# EAGLE design coilcube (EAGLE 6.5.0)
REV: C; TITLE: Coilcube

## Sheet 1 of 2: EPIC & Programmer
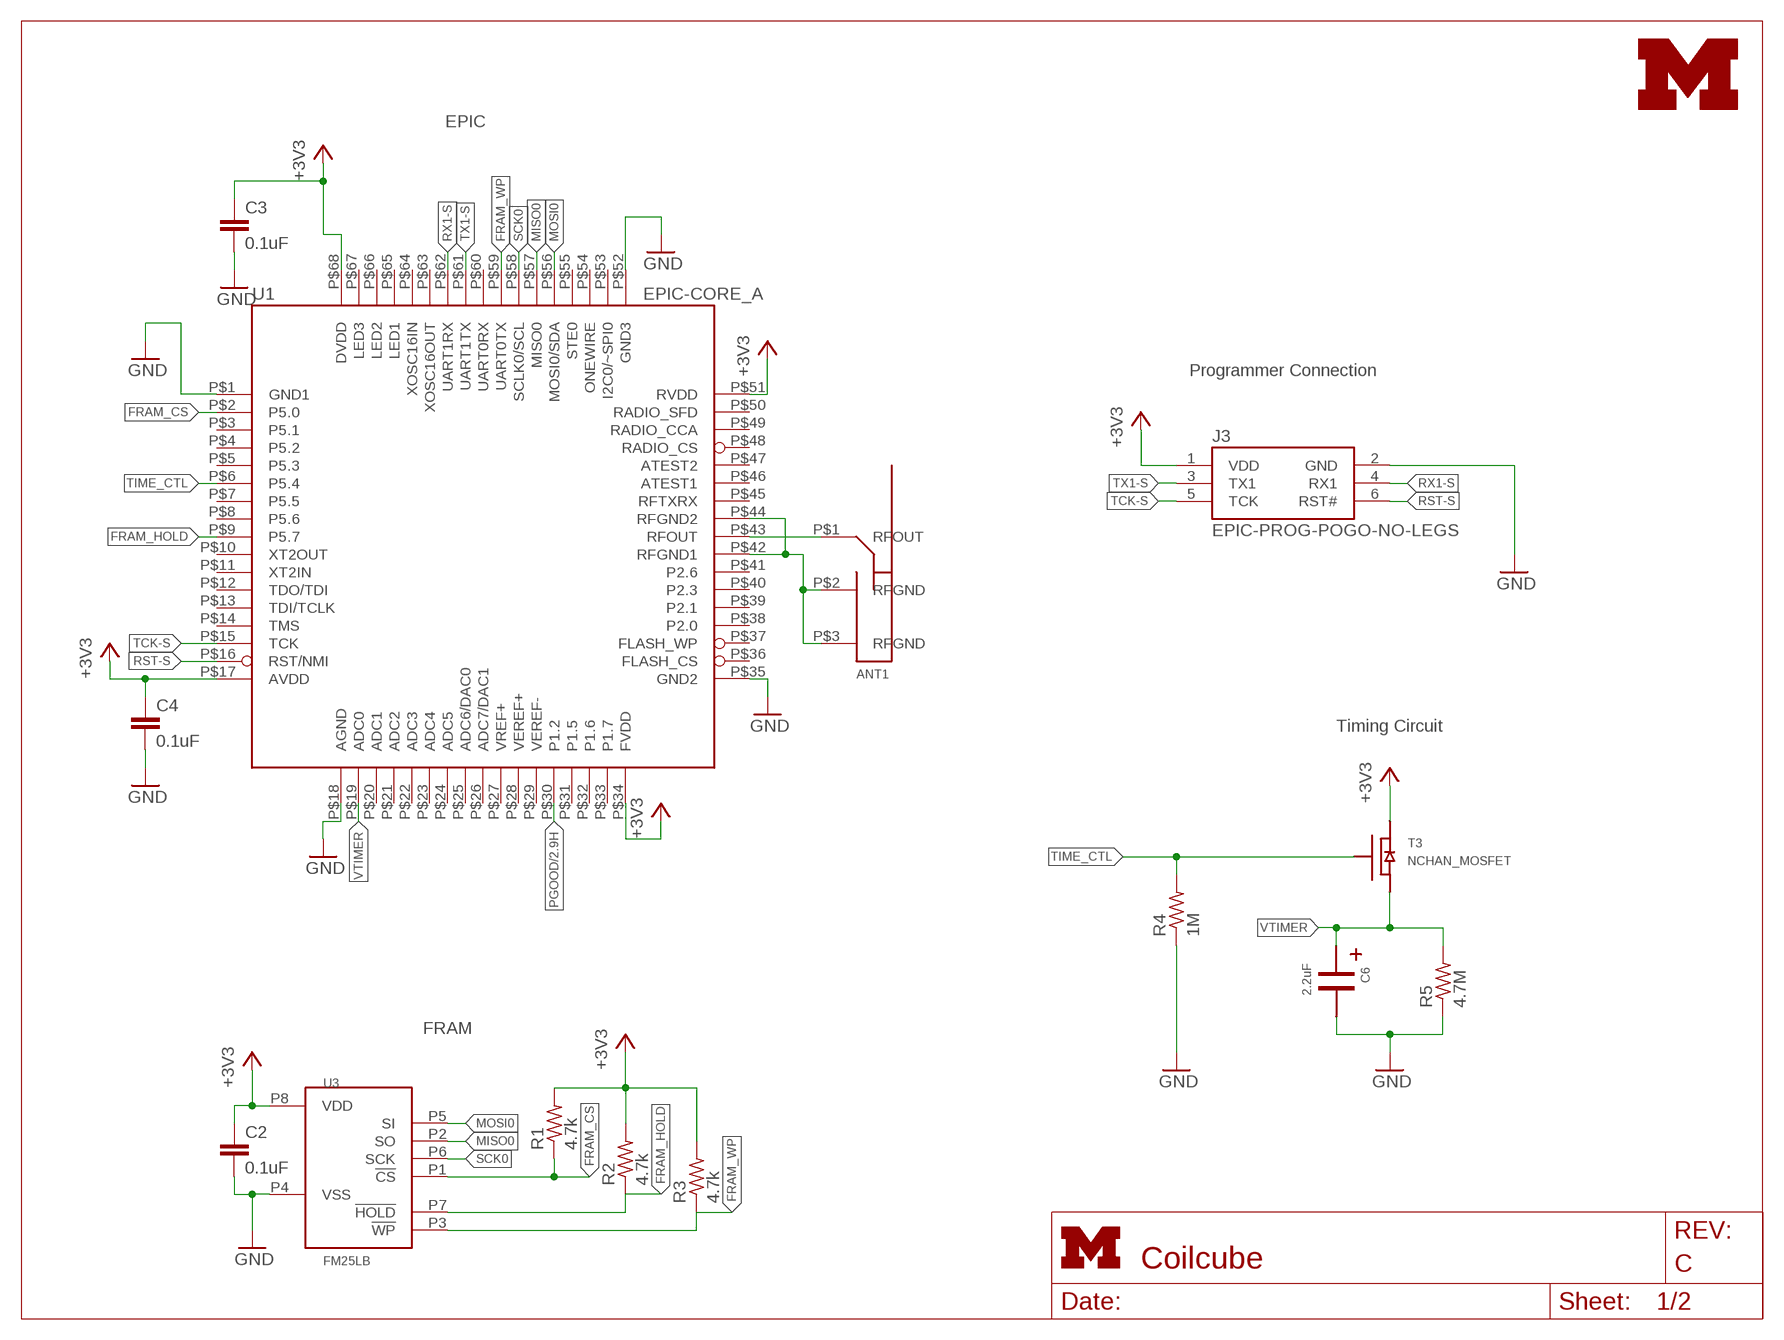
[diagram p0: schematic, sheet 1]
FRAME1 (LETTER_L): HEIGHT: 8.5in; WIDTH: 11in

### Parts
ANT1  PIFA-2.4GHZ  [PIFA-2.4GHZ]
C2  0.1uF  C-EUC0603  [C0603]
C3  0.1uF  C-EUC0603  [C0603]
C4  0.1uF  C-EUC0603  [C0603]
C6  2.2uF  CAP_POLEA1MM5  [CPOL_EEA_1MM5]
J3  EPIC-PROG-POGO-NO-LEGS  [TC2030-IDC-NL]
R1  4.7k  R-US_R0603  [R0603]
R2  4.7k  R-US_R0603  [R0603]
R3  4.7k  R-US_R0603  [R0603]
R4  1M  R-US_R0603  [R0603]
R5  4.7M  R-US_R0603  [R0603]
T3  NCHAN_MOSFET  [NCHAN_MOSFET]
U1  EPIC-CORE_A  [EPIC-LCC68]
U3  FM25LB  [SOIC_8]
U$1  UMICH_SOLID_MEDIUM  [UMICH_SOLID_200MIL]

### Nets
+3V3: C2.1 C3.1 C4.1 J3.1(VDD) R1.2 R2.2 R3.2 T3.D U1.P$17(AVDD) U1.P$34(FVDD) U1.P$51(RVDD) U1.P$68(DVDD) U3.P8(VDD) ; also sheet 2
FRAM_CS: R1.1 U1.P$2(P5.0) U3.P1(!CS)
FRAM_HOLD: R2.1 U1.P$9(P5.7) U3.P7(!HOLD)
FRAM_WP: R3.1 U1.P$59(UART0TX) U3.P3(!WP)
GND: C2.2 C3.2 C4.2 C6.- J3.2(GND) R4.1 R5.1 U1.P$1(GND1) U1.P$18(AGND) U1.P$35(GND2) U1.P$52(GND3) U3.P4(VSS) ; also sheet 2
MISO0: U1.P$57(MISO0) U3.P2(SO)
MOSI0: U1.P$56(MOSI0/SDA) U3.P5(SI)
N$1: ANT1.P$1(RFOUT) U1.P$43(RFOUT)
PGOOD: U1.P$30(P1.2) ; also sheet 2
RFGND: ANT1.P$2(RFGND) ANT1.P$3(RFGND) U1.P$42(RFGND1) U1.P$44(RFGND2)
RST-S: J3.6(RST#) U1.P$16(RST/NMI)
RX1-S: J3.4(RX1) U1.P$62(UART1RX)
SCK0: U1.P$58(SCLK0/SCL) U3.P6(SCK)
TCK-S: J3.5(TCK) U1.P$15(TCK)
TIME_CTL: R4.2 T3.G U1.P$6(P5.4)
TX1-S: J3.3(TX1) U1.P$61(UART1TX)
VTIMER: C6.+ R5.2 T3.S U1.P$19(ADC0)
Unconnected: U1.P$3(P5.1) U1.P$4(P5.2) U1.P$5(P5.3) U1.P$7(P5.5) U1.P$8(P5.6) U1.P$10(XT2OUT) U1.P$11(XT2IN) U1.P$12(TDO/TDI) U1.P$13(TDI/TCLK) U1.P$14(TMS) U1.P$20(ADC1) U1.P$21(ADC2) U1.P$22(ADC3) U1.P$23(ADC4) U1.P$24(ADC5) U1.P$25(ADC6/DAC0) U1.P$26(ADC7/DAC1) U1.P$27(VREF+) U1.P$28(VEREF+) U1.P$29(VEREF-) U1.P$31(P1.5) U1.P$32(P1.6) U1.P$33(P1.7) U1.P$36(FLASH_CS) U1.P$37(FLASH_WP) U1.P$38(P2.0) U1.P$39(P2.1) U1.P$40(P2.3) U1.P$41(P2.6) U1.P$45(RFTXRX) U1.P$46(ATEST1) U1.P$47(ATEST2) U1.P$48(RADIO_CS) U1.P$49(RADIO_CCA) U1.P$50(RADIO_SFD) U1.P$53(I2C0/~SPI0) U1.P$54(ONEWIRE) U1.P$55(STE0) U1.P$60(UART0RX) U1.P$63(XOSC16OUT) U1.P$64(XOSC16IN) U1.P$65(LED1) U1.P$66(LED2) U1.P$67(LED3)

### Notes on the sheet
- EPIC
- Programmer Connection
- Timing Circuit
- FRAM

## Sheet 2 of 2: Power Supply
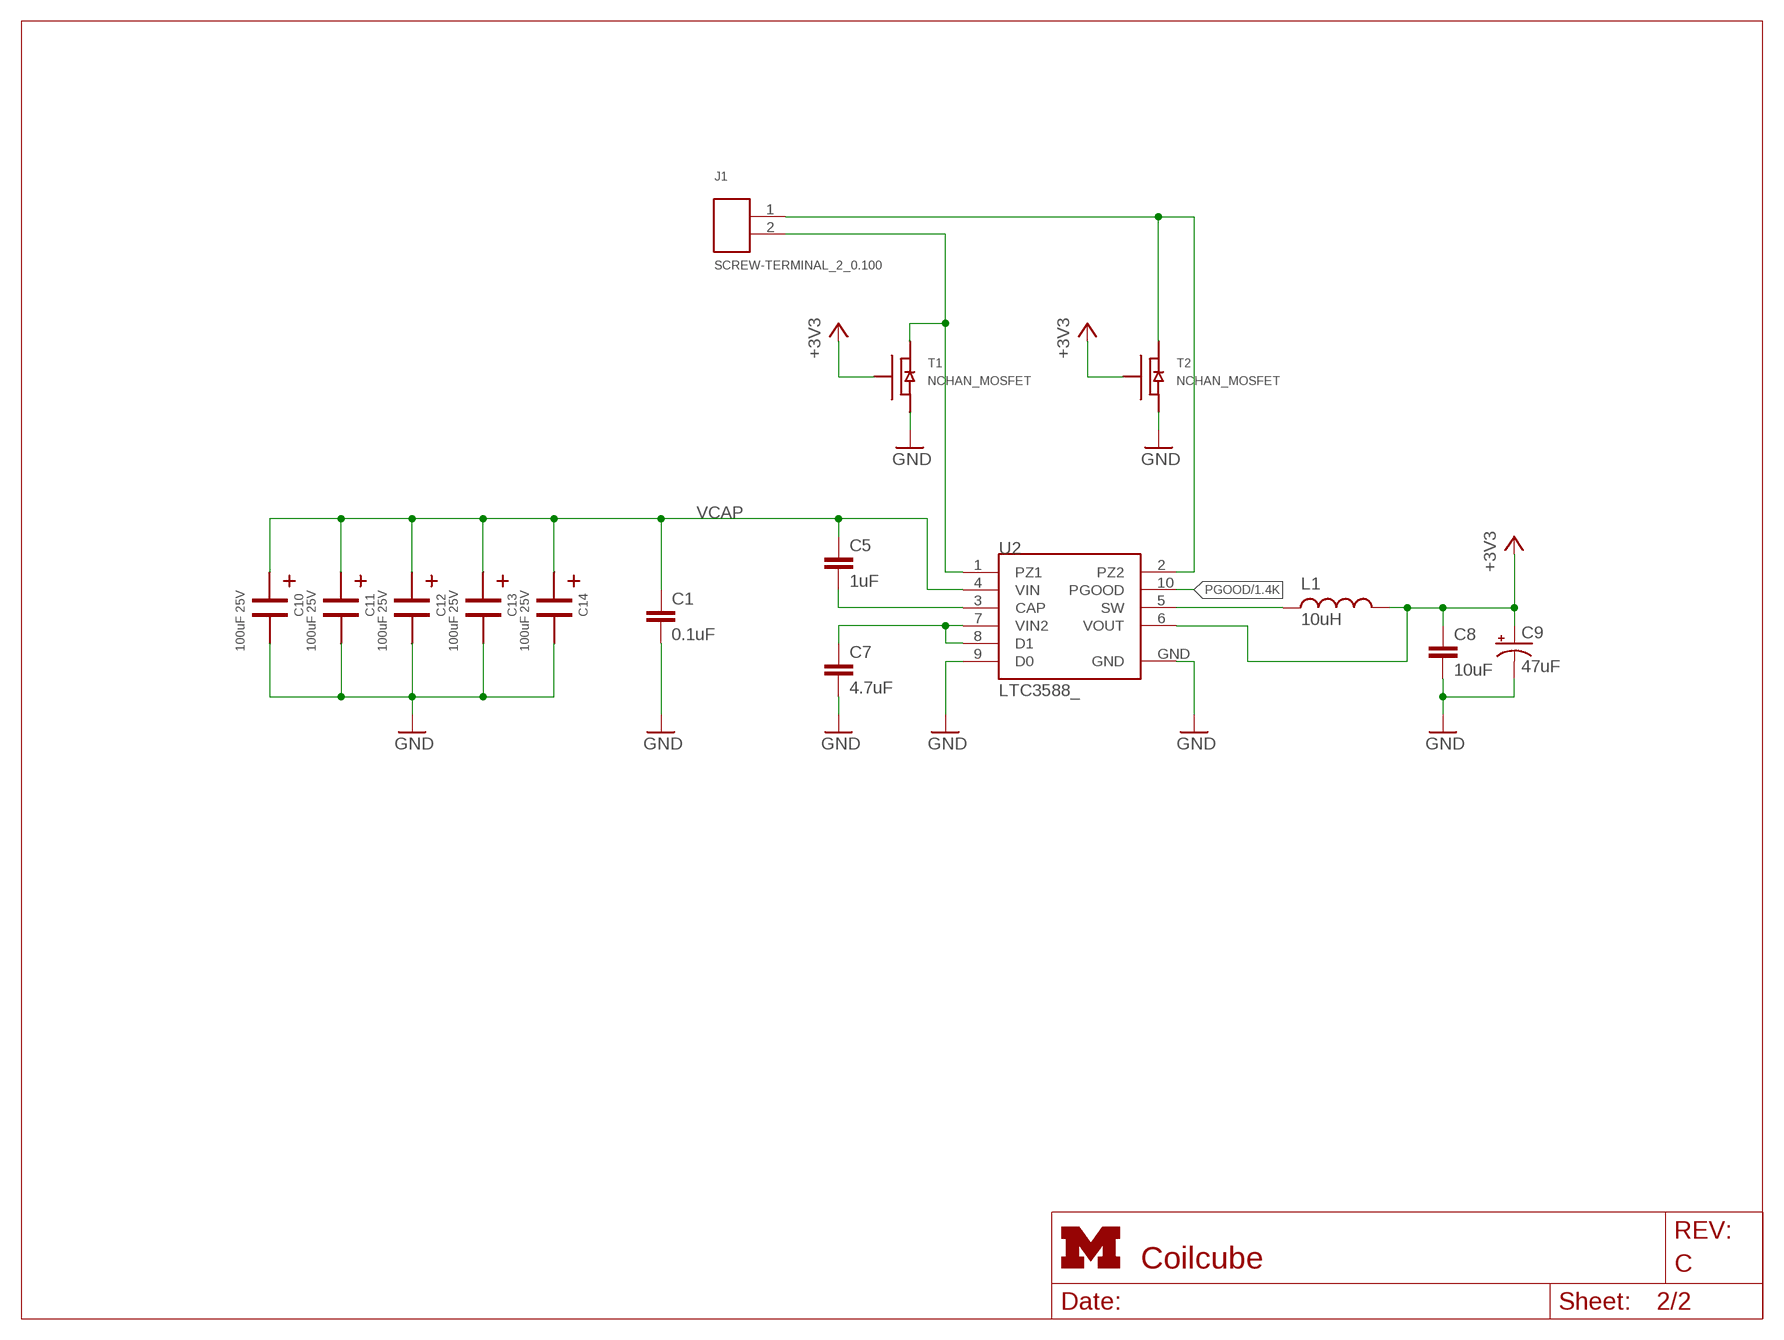
[diagram p1: schematic, sheet 2]
FRAME5 (LETTER_L): HEIGHT: 8.5in; WIDTH: 11in

### Parts
C1  0.1uF  C-EUC0603  [C0603]
C5  1uF  C-EUC0603  [C0603]
C7  4.7uF  C-EUC0603  [C0603]
C8  10uF  C-EUC1206  [C1206]
C9  47uF  CAP_POL1206  [EIA3216]
C10  100uF 25V  2917_CAP_POL  [2917_CAP_POL]
C11  100uF 25V  2917_CAP_POL  [2917_CAP_POL]
C12  100uF 25V  2917_CAP_POL  [2917_CAP_POL]
C13  100uF 25V  2917_CAP_POL  [2917_CAP_POL]
C14  100uF 25V  2917_CAP_POL  [2917_CAP_POL]
J1  SCREW-TERMINAL_2_0.100  [CONN_BLOCK_2]
L1  10uH  INDUCTOR1210  [1210]
T1  NCHAN_MOSFET  [NCHAN_MOSFET]
T2  NCHAN_MOSFET  [NCHAN_MOSFET]
U2  LTC3588_  [MSOP-10-GNDPAD]

### Nets
+3V3: C8.1 C9.A(+) L1.2 T1.G T2.G U2.6(VOUT) ; also sheet 1
GND: C1.2 C7.2 C8.2 C9.C(-) C10.- C11.- C12.- C13.- C14.- T1.S T2.S U2.9(D0) U2.GND ; also sheet 1
N$20: L1.1 U2.5(SW)
N$22: C5.2 U2.3(CAP)
PGOOD: U2.10(PGOOD) ; also sheet 1
PZ1: J1.2 T1.D U2.1(PZ1)
PZ2: J1.1 T2.D U2.2(PZ2)
VCAP: C1.1 C5.1 C10.+ C11.+ C12.+ C13.+ C14.+ U2.4(VIN)
VIN2: C7.1 U2.7(VIN2) U2.8(D1)

## Library data of the parts
ANT1 = berkeley-epic:PIFA-2.4GHZ
C1-C4 = rcl:C-EU: CAPACITOR, European symbol; DIGIKEY: 445-1316-1-ND
C5 = rcl:C-EU: CAPACITOR, European symbol; DIGIKEY: 445-1321-1-ND
C6 = coilcube:CAP_POL; DIGIKEY: P14506-ND
C7 = rcl:C-EU: CAPACITOR, European symbol; DIGIKEY: 445-5178-1-ND
C8 = rcl:C-EU: CAPACITOR, European symbol; DIGIKEY: 399-8152-1-ND
C9 = SparkFun-Passives:CAP_POL: Capacitor Polarized These are standard SMD and PTH capacitors. Normally 10uF, 47uF, and 100uF in electrolytic and tantalum varieties. Always verify the external diameter of the through hole cap, it varies with capacity, voltage, and manufacturer. The EIA devices should be standard.; DIGIKEY: 399-3700-1-ND
C10-C14 = coilcube:2917_CAP_POL; DIGIKEY: 399-5175-1-ND
J1 = headers:SCREW-TERMINAL_2_0.100: 2x 0.100 in screw terminal block; DIGIKEY: 277-1273-ND
J3 = epic:EPIC-PROG-POGO: Epic programmer based on the Tag Connect pogo pin cable.; TAG-CONNECT: TC2030-IDC-NL
L1 = SparkFun-Passives:INDUCTOR: Inductors Basic Inductor/Choke - 0603 and 1206. Footprints are not proven and vary greatly between part numbers.; DIGIKEY: 587-1625-1-ND
R1-R3 = rcl:R-US_: RESISTOR, American symbol; DIGIKEY: P4.7KGCT-ND
R4 = rcl:R-US_: RESISTOR, American symbol; DIGIKEY: RHM1.00MCFCT-ND
R5 = rcl:R-US_: RESISTOR, American symbol; DIGIKEY: RHM4.7MCGDKR-ND
T1 T2 = Power_Metering:NCHAN_MOSFET; DIGIKEY: SI1302DL-T1-GE3CT-ND
T3 = Power_Metering:NCHAN_MOSFET; DIGIKEY: 568-3244-1-ND
U1 = berkeley-epic:EPIC-CORE_A
U2 = SparkFun-PowerIC:LTC3588: Energy Harvesting Power Supply; DIGIKEY: LTC3588EMSE-1#PBF-ND
U3 = coilcube:FM25LB; DIGIKEY: 428-3210-ND
U$1 = logos:UMICH_SOLID

## Board
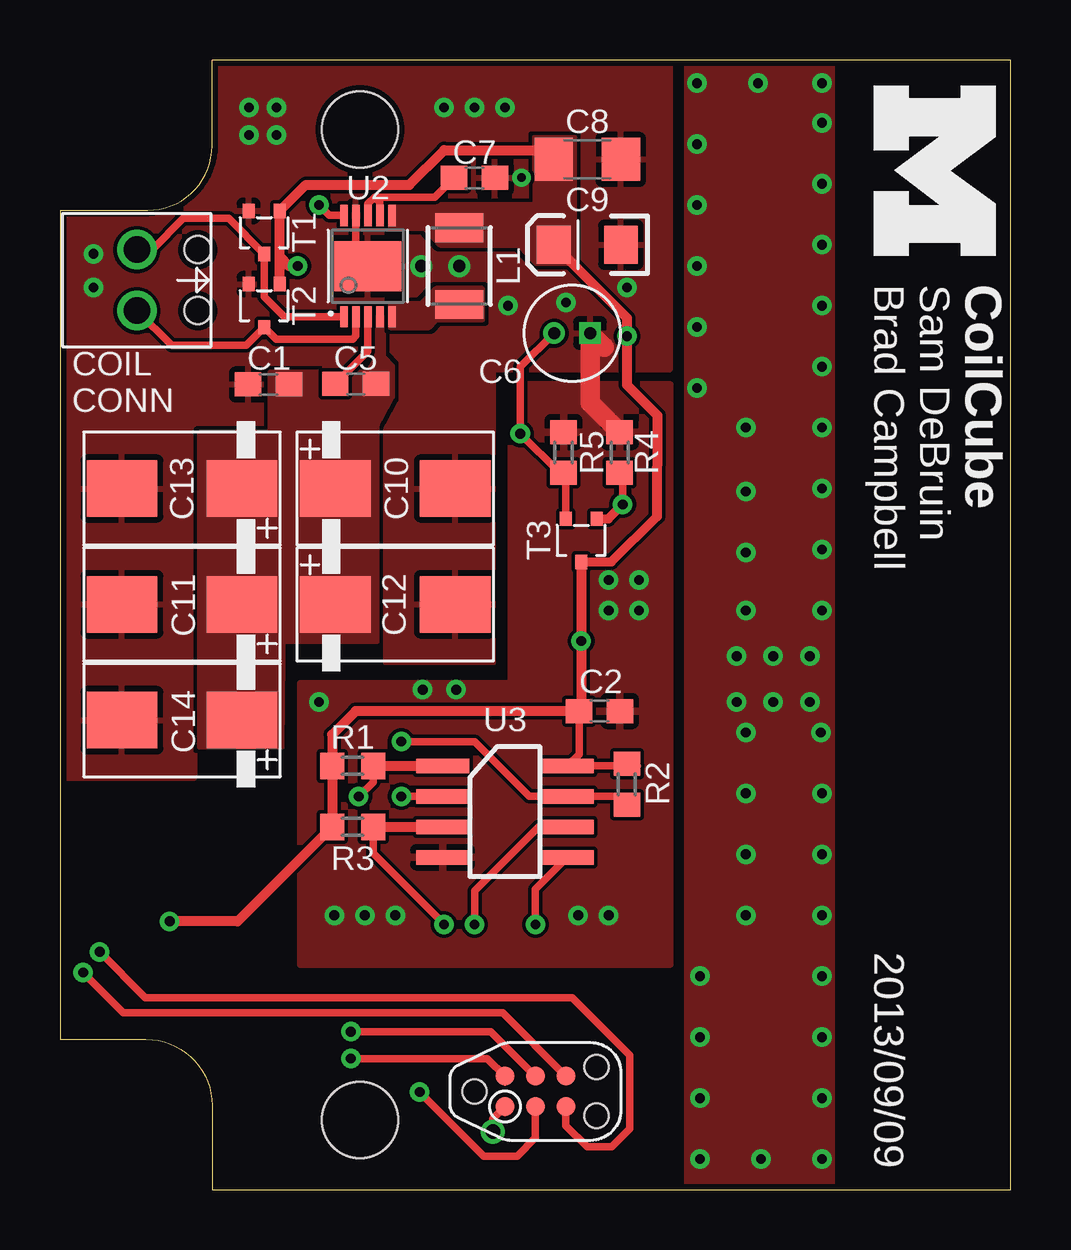
[diagram p2: board, top side]
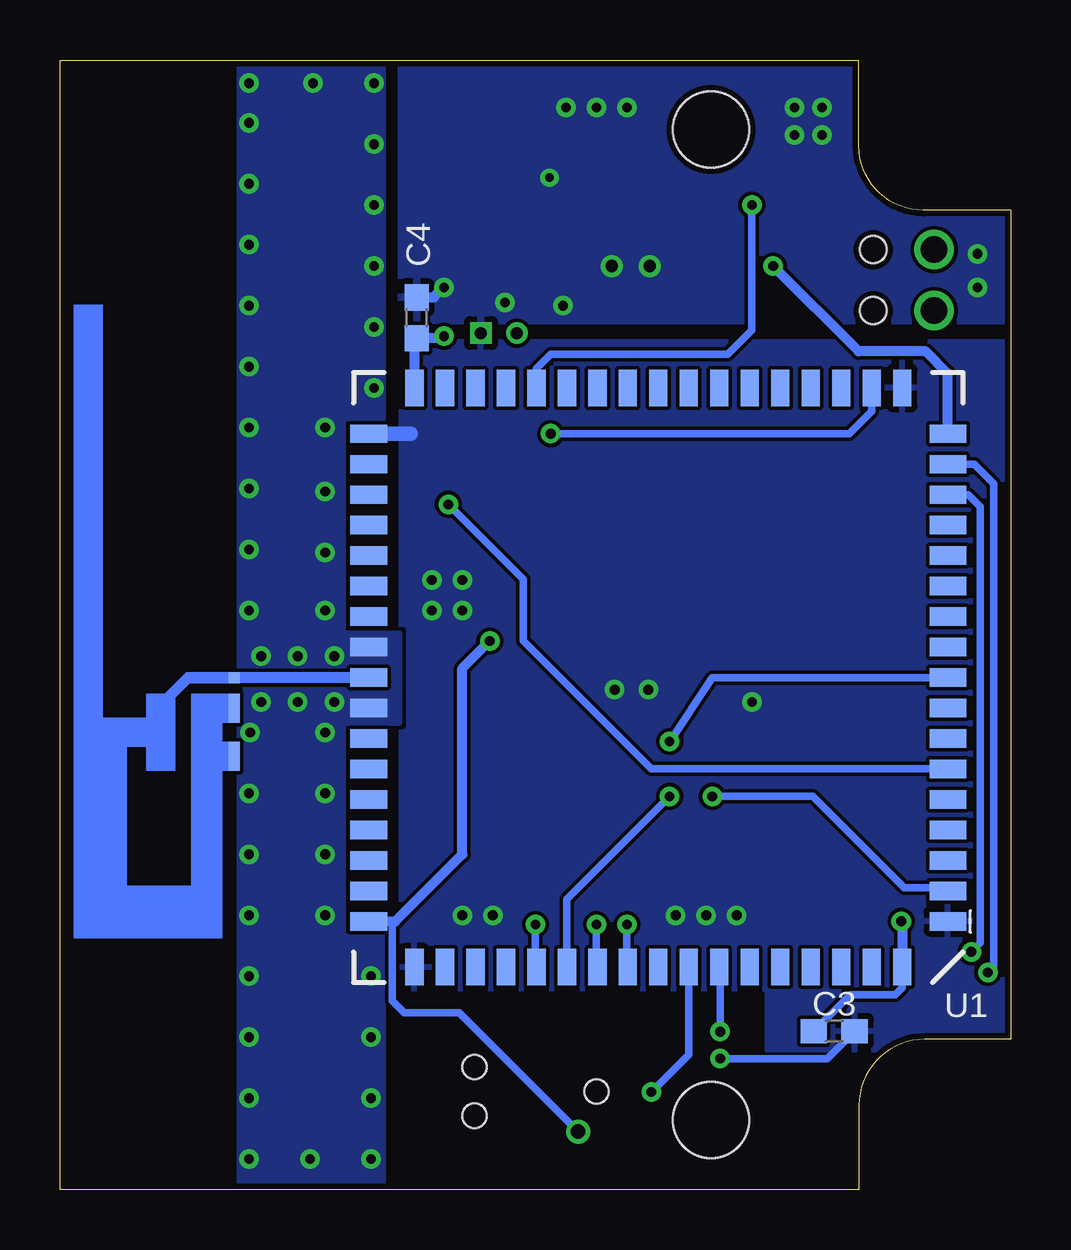
[diagram p3: board, bottom side, seen from below]

Size 39.62 x 47.07 mm. Coordinates in mm from the lower left corner, seen from the top.
Outline: 6.34,0 39.62,0 39.62,47.07 6.34,47.07 6.34,43.49 arc-90 3.65,40.8 0,40.8 0,6.26 3.58,6.26 arc-90 6.34,3.51 6.34,0
Copper layers (1*16): Top 0.0178mm / dielectric 59mil / Bottom 0.0178mm
Design rules "sunstone-2lyr_v1.0.0.3 *": minimum track width 6mil, minimum drill 14mil, track to track 6mil, track to pad 6mil, pad to pad 6mil, via to via 6mil, smd to smd 6mil, copper to edge 10mil, drill to drill 16mil, minimum pad ring 8mil, minimum via ring 8mil, stop-mask expansion 3mil, vias tented up to drill 20mil, thermal gap 10mil
Holes 3.17 mm at 12.5,44.17 12.5,2.9
tKeepout: area 10.1,0.5 to 14.9,5.3; area 10.1,41.8 to 14.9,46.6
Milling: 12 lines

### Footprints (pad centres in the part's own frame; a part is rotated, then mirrored left to right if it is on the bottom)
PIFA-2.4GHZ = smd 0.46 x 0.46: P$1 -2.65,-1.495 | smd 0.46 x 1.2: P$2 -2.655,1.785; P$3 -2.65,-0.215
C0603 = smd 1.1 x 1: 1 -0.85,0; 2 0.85,0
CPOL_EEA_1MM5 = drill 0.5: + 0.75,0 | drill 0.5 square: - -0.75,0
C1206 = smd 1.6 x 1.8: 1 -1.4,0; 2 1.4,0
EIA3216 = smd 1.4 x 1.6: A 1.4,0; C -1.4,0
2917_CAP_POL = smd 2.95 x 2.35: + -2.5,0; - 2.5,0
CONN_BLOCK_2 = drill 1.1: 1 -1.27,0; 2 1.27,0 | hole 1.12: -1.27,-2.54; 1.27,-2.54
TC2030-IDC-NL = smd 0.787 x 0.787: 1 -1.27,-0.635; 2 -1.27,0.635; 3 0,-0.635; 4 0,0.635; 5 1.27,-0.635; 6 1.27,0.635 | hole 1.016: -2.54,0; 2.54,1.016; 2.54,-1.016
1210 = smd 1.2 x 2: 1 -1.6,0; 2 1.6,0
R0603 = smd 1 x 1.1: 1 -0.85,0; 2 0.85,0
NCHAN_MOSFET = smd 0.6 x 0.5: D -0.9,0; G 0.9,-0.65; S 0.9,0.65
EPIC-LCC68 = smd 1.524 x 0.762: P$1 -12.065,10.16; P$2 -12.065,8.89; P$3 -12.065,7.62; P$4 -12.065,6.35; P$5 -12.065,5.08; P$6 -12.065,3.81; P$7 -12.065,2.54; P$8 -12.065,1.27; P$9 -12.065,0; P$10 -12.065,-1.27; P$11 -12.065,-2.54; P$12 -12.065,-3.81; P$13 -12.065,-5.08; P$14 -12.065,-6.35; P$15 -12.065,-7.62; P$16 -12.065,-8.89; P$17 -12.065,-10.16; P$35 12.065,-10.16; P$36 12.065,-8.89; P$37 12.065,-7.62; P$38 12.065,-6.35; P$39 12.065,-5.08; P$40 12.065,-3.81; P$41 12.065,-2.54; P$42 12.065,-1.27; P$43 12.065,0; P$44 12.065,1.27; P$45 12.065,2.54; P$46 12.065,3.81; P$47 12.065,5.08; P$48 12.065,6.35; P$49 12.065,7.62; P$50 12.065,8.89; P$51 12.065,10.16 | smd 0.762 x 1.524: P$18 -10.16,-12.065; P$19 -8.89,-12.065; P$20 -7.62,-12.065; P$21 -6.35,-12.065; P$22 -5.08,-12.065; P$23 -3.81,-12.065; P$24 -2.54,-12.065; P$25 -1.27,-12.065; P$26 0,-12.065; P$27 1.27,-12.065; P$28 2.54,-12.065; P$29 3.81,-12.065; P$30 5.08,-12.065; P$31 6.35,-12.065; P$32 7.62,-12.065; P$33 8.89,-12.065; P$34 10.16,-12.065; P$52 10.16,12.065; P$53 8.89,12.065; P$54 7.62,12.065; P$55 6.35,12.065; P$56 5.08,12.065; P$57 3.81,12.065; P$58 2.54,12.065; P$59 1.27,12.065; P$60 0,12.065; P$61 -1.27,12.065; P$62 -2.54,12.065; P$63 -3.81,12.065; P$64 -5.08,12.065; P$65 -6.35,12.065; P$66 -7.62,12.065; P$67 -8.89,12.065; P$68 -10.16,12.065
MSOP-10-GNDPAD = smd 0.305 x 0.889: 1 -1,-2.11; 2 -0.5,-2.11; 3 0,-2.11; 4 0.5,-2.11; 5 1,-2.11; 6 1,2.11; 7 0.5,2.11; 8 0,2.11; 9 -0.5,2.11; 10 -1,2.11 | smd 2.794 x 2.083: GND 0,0
SOIC_8 = smd 2.2 x 0.6: P1 -2.6,1.905; P2 -2.6,0.635; P3 -2.6,-0.635; P4 -2.6,-1.905; P5 2.6,-1.905; P6 2.6,-0.635; P7 2.6,0.635; P8 2.6,1.905

### Placement (x,y rotation side)
ANT1  35.01,19.84 180 bottom
C1  8.69,33.55 180 top
C2  22.48,19.94 0 top
C3  7.37,6.6 0 bottom
C4  24.77,36.32 90 bottom
C5  12.32,33.58 180 top
C6  21.34,35.69 180 top
C7  17.27,42.15 0 top
C8  21.97,42.93 0 top
C9  21.97,39.37 180 top
C10  13.97,29.21 0 top
C11  5.08,24.38 180 top
C12  13.97,24.38 0 top
C13  5.08,29.21 180 top
C14  5.08,19.56 180 top
J1  3.2,37.9 90 top
J3  19.81,4.09 0 top
L1  16.64,38.48 90 top
R1  12.19,17.65 180 top
R2  23.62,16.89 90 top
R3  12.19,15.11 180 top
R4  23.32,30.71 270 top
R5  20.98,30.71 270 top
T1  8.51,39.88 90 top
T2  8.51,36.83 90 top
T3  21.72,27.05 90 top
U1  14.69,21.34 180 bottom
U2  12.83,38.48 0 top
U3  18.54,15.75 0 top
U$1  33.91,46 270 top

### Tracks (layer width: path | path; a pad name or v marks a point on that pad's centre or on a via)
+3V3  (via drill 0.41, 0.6)
  Top 0.254: 20.32,43.18 C8.1
  Top 0.305: R2.2 23.53,17.65 U3.P8 21.63,18.14 C2.1 | J3.1 18.03,2.95 v18.03,2.41
  Top 0.381: T3.D 22.98,26.15 24.87,28.04
  Top 0.406: T2.G 9.16,38.86 | 9.16,38.86 T1.G 10.24,41.86 14.55,41.86 16,43.31 20.19,43.31 C8.1 | C9.A 23.62,36.32 v23.62,35.56 23.62,33.53 24.89,32.26 24.87,28.04 | T3.D v21.72,22.86 21.72,20.03 C2.1 12.32,19.94 11.34,18.96 R1.2 R3.2 7.41,11.18 v4.57,11.18 | 23.53,17.65 24,17.65 | v9.91,38.48 9.54,38.48 9.16,38.86
  Bottom 0.305: U1.P$68 4.53,8.42 4.83,8.13 6.69,8.13 C3.1 | 25.65,11.18 25.78,11.05 25.78,7.87 25.27,7.37 22.99,7.37 v18.03,2.41
  Bottom 0.406: v23.62,35.56 23.58,35.47 C4.1 24.85,35.38 U1.P$34 | v4.57,11.18 4.53,11.14 U1.P$68 | U1.P$51 25.65,11.18 22.86,13.97 22.86,21.72 v21.72,22.86 | U1.P$17 2.63,34 3.56,34.92 6.35,34.92 v9.91,38.48
  pour Top (no thermals): 15.84,39.37 19.15,39.37 19.84,38.61 21.43,38.61 21.43,43.81 19.78,43.81 19.81,41.02 13.78,41.02 13.78,40.07 15.21,40.07
FRAM_CS  (via drill 0.41)
  Top 0.305: R1.1 13.04,16.98 v12.45,16.38
  Top 0.406: R1.1 U3.P1
  Bottom 0.305: U1.P$2 2.76,12.57 4.45,12.57 8.26,16.38 v12.45,16.38
FRAM_HOLD  (via drill 0.41)
  Top 0.305: R2.1 23.28,16.38 U3.P7 19.56,16.38 17.27,18.67 v14.22,18.67
  Bottom 0.305: U1.P$9 12.45,21.34 v14.22,18.67
FRAM_WP  (via drill 0.41)
  Top 0.305: R3.1 13.04,14.01 v16,11.05
  Top 0.406: R3.1 U3.P3
  Bottom 0.305: v16,11.05 16,9.31 U1.P$59
GND  (via drill 0.36, 0.41, 0.51)
  Top 0.305: U2.9 12.33,38.98 U2.GND | J3.2 17.8,5.46 v12.12,5.46
  Top 0.813: 22.67,35.11 C6.- 22.09,32.79 R4.1
  Bottom 0.305: v12.12,5.46 7.66,5.46 C3.2
  Bottom 0.406: C4.2 24.04,37.17 v23.62,37.59
  Bottom 0.61: U1.P$35 25.02,31.5
  other vias: 15.05,38.48 10.79,20.32 15.11,20.83 16.51,20.83 22.86,25.4 24.13,25.4 24.13,24.13 22.86,24.13 22.86,11.43 21.59,11.43 13.97,11.43 12.7,11.43 11.43,11.43 19.23,42.16 7.87,45.09 9.02,45.09 9.02,43.94 7.87,43.94 21.08,36.96 18.67,36.83 16,45.09 17.27,45.09 18.54,45.09 1.4,38.99 1.4,37.59 16.64,38.48
  pour Bottom (rank 6): 0,35.31 25.4,35.31 25.4,8.38 10.16,8.38 10.16,5.84 0,5.84
  pour Top (rank 6): 0,17.14 0,46.99 25.4,46.99 25.4,34.16 18.03,34.16 18.03,21.97 13.59,21.97 13.59,31.5 5.59,31.5 5.59,17.14
  pour Top: 18.8,33.53 25.4,33.53 25.4,9.4 10.03,9.4 10.03,21.08 18.8,21.08
  pour Bottom: 0,46.99 25.4,46.99 25.4,36.2 0,36.2
MISO0  (via drill 0.41)
  Top 0.305: U3.P2 v14.22,16.38
  Bottom 0.305: v14.22,16.38 18.5,12.1 U1.P$57
MOSI0  (via drill 0.41)
  Top 0.305: U3.P5 19.81,12.51 v19.81,11.05
  Bottom 0.305: v19.81,11.05 19.81,9.31 U1.P$56
N$1
  Bottom 0.406: ANT1.P$1
  Bottom 0.457: U1.P$43 ANT1.P$1
N$20
  pour Top (no thermals): 13.78,36.89 13.78,35.94 15.37,35.94 15.68,36.26 17.59,36.26 17.59,37.53 15.68,37.53 15.05,36.89
N$22
  Top 0.305: C5.2 12.83,34.94 U2.3
PGOOD  (via drill 0.41)
  Top 0.305: U2.10 11.23,40.59 v10.79,41.02
  Bottom 0.305: v10.79,41.02 10.79,35.81 11.81,34.8 19.18,34.8 19.77,34.2 U1.P$30
PZ1
  Top 0.305: U2.1 9.35,36.37 8.51,37.21 T1.D | T1.D | T1.D 7.03,40.46 5.13,40.46 3.83,39.17 J1.2
PZ2
  Top 0.254: 8.52,35.94 T2.D
  Top 0.305: U2.2 12.33,35.57 12.19,35.43 9.01,35.43 T2.D 7.76,35.18 4.65,35.18 J1.1
RFGND  (via drill 0.41)
  other vias: 28.19,22.23 28.19,20.32 28.57,19.05 31.24,22.23 31.24,20.32 31.7,19.05 31.75,16.51 31.75,13.97 31.75,11.43 31.75,8.89 31.75,24.13 31.75,26.67 31.75,31.75 31.75,29.21 31.75,34.29 29.72,22.23 29.72,20.32 28.57,24.13 31.75,36.83 31.75,39.37 31.75,41.91 31.75,44.45 31.75,46.1 26.54,46.1 31.75,6.35 31.75,3.81 31.75,1.27 26.54,43.56 26.54,41.02 26.54,38.48 26.54,35.94 26.54,33.4 28.57,31.75 28.57,29.08 28.57,26.54 28.57,16.51 28.57,13.97 28.57,11.43 26.67,8.89 26.67,6.35 26.67,3.81 26.67,1.27 29.21,1.27 29.08,46.1
  pour Bottom (no thermals): 26.16,47.07 32.16,47.07 32.16,0 26.16,0 26.16,10.54 27.81,10.54 27.81,19.46 25.48,19.46 25.48,23.16 27.81,23.16 27.81,32.13 26.16,32.13
  pour Top: 26.14,47.07 32.16,47.07 32.16,0 26.14,0
RST-S  (via drill 0.41)
  Top 0.305: J3.6 18.44,7.37 2.64,7.37 v0.96,9.04
  Bottom 0.305: U1.P$16 1.52,30.23 0.71,29.41 0.71,9.3 v0.96,9.04
RX1-S  (via drill 0.41)
  Top 0.305: J3.4 17.96,6.58 v12.12,6.58
  Bottom 0.305: v12.12,6.58 12.12,9.23 U1.P$62
SCK0  (via drill 0.41)
  Top 0.305: U3.P6 19.94,15.11 17.27,12.45 v17.27,11.05
  Bottom 0.305: v17.27,11.05 17.27,9.31 U1.P$58
TCK-S  (via drill 0.41)
  Top 0.305: v1.65,9.91 3.56,8 21.34,8 23.75,5.59 23.75,2.54 22.99,1.78 21.97,1.78 21.08,2.67 J3.5
  Bottom 0.305: v1.65,9.91 1.27,10.29 1.27,28.45 1.78,28.96 U1.P$15
TIME_CTL  (via drill 0.41)
  Top 0.305: R4.2 23.44,29.73 v23.44,28.55
  Top 0.381: T3.G 22.85,27.95 v23.44,28.55
  Bottom 0.305: U1.P$6 14.99,17.53 20.32,22.86 20.32,25.43 v23.44,28.55
TX1-S  (via drill 0.41)
  Top 0.305: J3.3 19.81,2.16 19.05,1.4 17.65,1.4 v14.99,4.06
  Bottom 0.305: 13.41,9.26 U1.P$61 13.42,5.63 v14.99,4.06
VCAP
  pour Top (rank 2, no thermals): 13.84,34.29 13.46,34.67 13.46,36.32 13.21,36.32 13.21,34.67 12.83,34.04 8.76,34.04 8.76,31.53 5.83,31.53 5.82,18.45 9.25,18.47 9.27,22.1 9.27,22.86 13.21,22.86 13.21,31.88 13.84,33.05
VIN2
  Top 0.305: U2.8 12.83,41.07 13.11,41.35 | U2.7 13.33,41.13 13.11,41.35 | 13.11,41.35 15.62,41.35 C7.1
VTIMER  (via drill 0.41)
  Top 0.305: T3.S 21.07,29.77 R5.2 20.81,29.86 v19.18,31.5 19.18,34.28 C6.+
  Bottom 0.305: v19.18,31.5 6.73,31.5 5.8,32.42 U1.P$19

### Text on the board
tPlace: Brad Campbell | Sam DeBruin | CoilCube | COIL / CONN | 2013/09/09